# EAGLE design Wifi_micro (EAGLE 7.2.0)
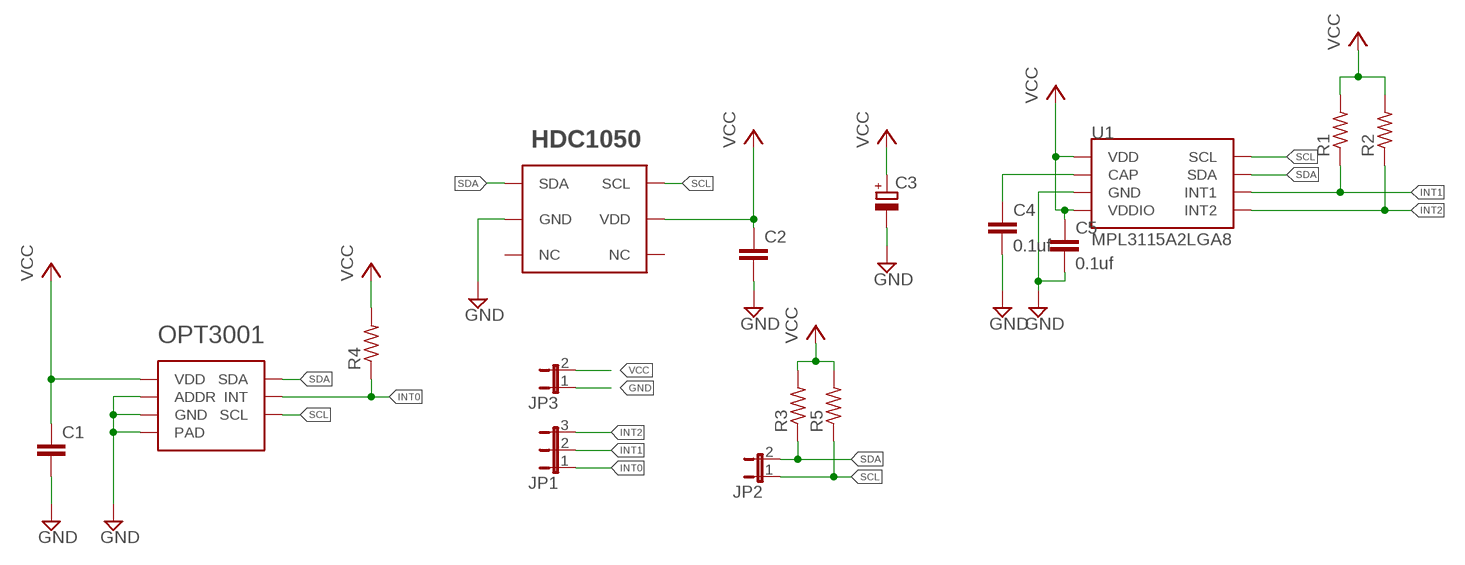
[diagram p0: schematic, sheet 1]

## Parts
C1  C-EUC1206  [C1206]
C2  C-EUC1206  [C1206]
C3  CPOL-EUE2.5-5  [E2,5-5]
C4  0.1uf  C-EUC1206  [C1206]
C5  0.1uf  C-EUC1206  [C1206]
HDC1050  HDC1050  [PWSON-6]
JP1  JP2E  [JP2]
JP2  JP1E  [JP1]
JP3  JP1E  [JP1]
OPT3001  OPT3001  [OPT3001]
R1  R-US_0204/5  [0204/5]
R2  R-US_0204/5  [0204/5]
R3  R-US_0204/5  [0204/5]
R4  R-US_0204/5  [0204/5]
R5  R-US_0204/5  [0204/5]
U1  MPL3115A2LGA8  [LGA8]

## Nets
GND: C1.2 C2.2 C3.- C4.2 C5.2 HDC1050.P$2(GND) JP3.1 OPT3001.P$2(ADDR) OPT3001.P$3(GND) OPT3001.P$7(PAD) U1.3(GND)
INT0: JP1.1 OPT3001.P$5(INT) R4.1
INT1: JP1.2 R1.1 U1.6(INT1)
INT2: JP1.3 R2.1 U1.5(INT2)
N$5: C4.1 U1.2(CAP)
SCL: HDC1050.P$6(SCL) JP2.1 OPT3001.P$4(SCL) R5.1 U1.8(SCL)
SDA: HDC1050.P$1(SDA) JP2.2 OPT3001.P$6(SDA) R3.1 U1.7(SDA)
VCC: C1.1 C2.1 C3.+ C5.1 HDC1050.P$5(VDD) JP3.2 OPT3001.P$1(VDD) R1.2 R2.2 R3.2 R4.2 R5.2 U1.1(VDD) U1.4(VDDIO)
Unconnected: HDC1050.P$3(NC) HDC1050.P$4(NC)

## Library data of the parts
C1 C2 C4 C5 = rcl:C-EU: CAPACITOR, European symbol
C3 = rcl:CPOL-EU: POLARIZED CAPACITOR, European symbol
HDC1050 = hdc1050:HDC1050: HDC1050 - Digital Humidity Sensor Technical Specifications: VCC: 2.7 - 5.5V Relative Humidity Accuracy ±3% Temperature Accuracy ±0.2°C Max Resolution: 14 bit Interface:I2C Operating Temperat ure: -40°C t o 125 °C Avg Current:710 nA @ 1sps, 11 bit RH Measurement 1.3 µA @ 1sps, 11 bit RH and Temperature 100 nA Sleep Mode Current
JP1 = jumper:JP2E: JUMPER
JP2 JP3 = jumper:JP1E: JUMPER
OPT3001 = my_own:OPT3001: OPT3001-Ambient Light Sensor Technical Specifications: VDD: 1.6 to 3.6V 5.5V tolerant I/O Operating Temp: -40 to 85C Package: USON-6
R1-R3 R5 = resistor:R-US_: RESISTOR, American symbol
R4 = rcl:R-US_: RESISTOR, American symbol
U1 = SparkFun-Sensors:MPL3115A2: Altimeter/Pressure Sensor, I2C, 1.95V-3.6V supply, 50 to 110kPa; PROD_ID: IC-10869

## Net classes
0 default: width 0.406 mm, drill 0.6 mm, clearance 0.305 mm

## Board
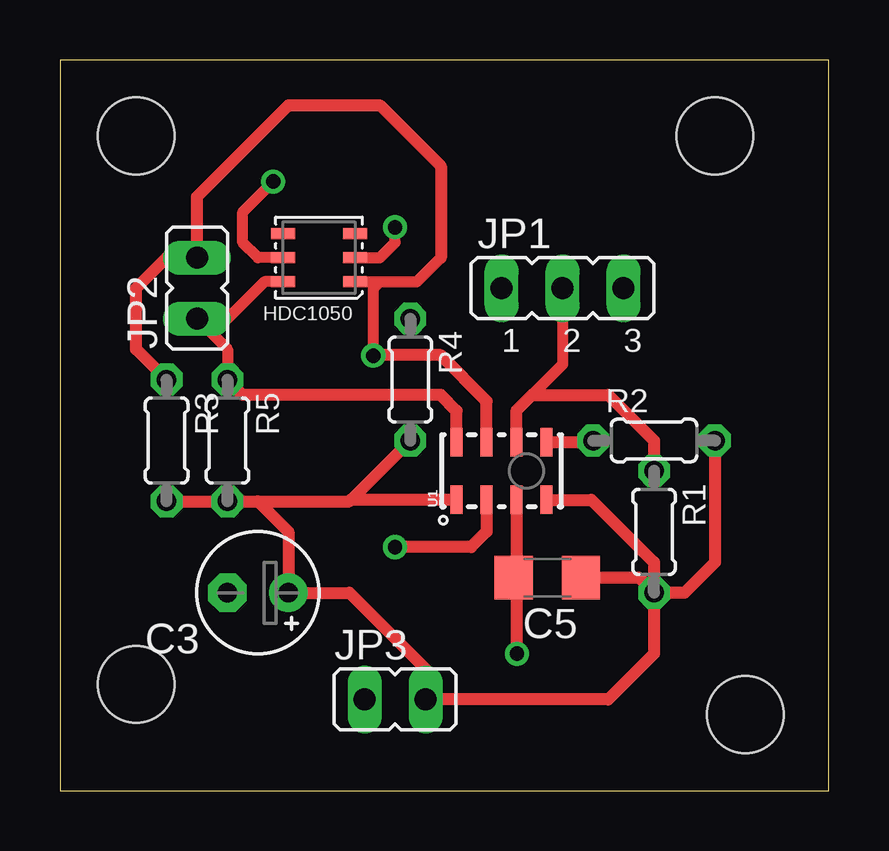
[diagram p1: board, top side]
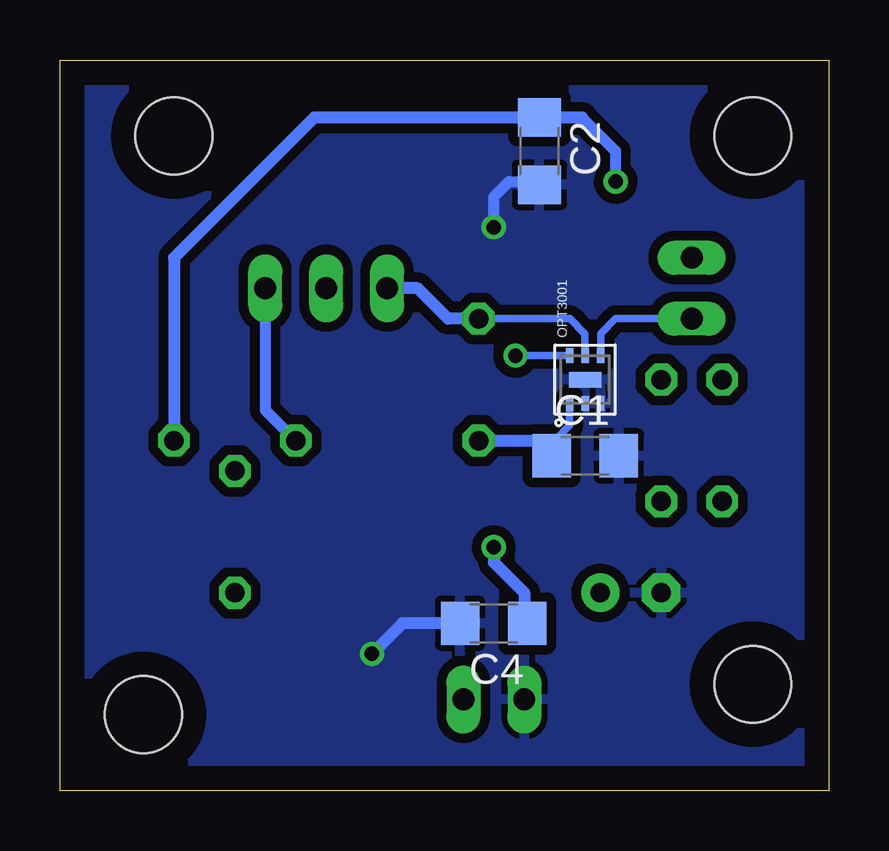
[diagram p2: board, bottom side, seen from below]

Size 32.06 x 30.47 mm. Coordinates in mm from the lower left corner, seen from the top.
Outline: 0,0 32.06,0 32.06,30.47 0,30.47 0,0
Copper layers (1*16): Top 0.035mm / dielectric 1.5mm / Bottom 0.035mm
Design rules "default": minimum track width 10mil, minimum drill 24mil, track to track 8mil, track to pad 8mil, pad to pad 8mil, via to via 8mil, smd to smd 8mil, copper to edge 40mil, drill to drill 8mil, minimum pad ring 10mil, minimum via ring 8mil, stop-mask expansion 4mil, vias tented up to drill 0mil, thermal gap 10mil
Holes 3.2 mm at 3.18,27.3 3.18,4.45 28.57,3.17 27.31,27.3

### Footprints (pad centres in the part's own frame; a part is rotated, then mirrored left to right if it is on the bottom)
C1206 = smd 1.6 x 1.8: 1 -1.4,0; 2 1.4,0
E2,5-5 = drill 0.813 pad 1.6: + -1.27,0 | drill 0.813 pad 1.6 octagon: - 1.27,0
PWSON-6 = smd 1 x 0.45: P$1 -1.5,1; P$2 -1.5,0; P$3 -1.5,-1; P$4 1.5,-1; P$5 1.5,0; P$6 1.5,1
JP2 = drill 0.914 long: 1 -2.54,0; 2 0,0; 3 2.54,0
JP1 = drill 0.914 long: 1 0,-1.27; 2 0,1.27
OPT3001 = smd 0.61 x 0.305: P$1 -1,0.65; P$2 -1,0; P$3 -1,-0.65; P$4 1,-0.65; P$5 1,0; P$6 1,0.65 | smd 0.65 x 1.35: P$7 0,0
0204/5 = drill 0.813 octagon: 1 -2.54,0; 2 2.54,0
LGA8 = smd 1.2 x 0.5: 1 -1.2,1.875; 2 -1.2,0.625; 3 -1.2,-0.625; 4 -1.2,-1.875; 5 1.2,-1.875; 6 1.2,-0.625; 7 1.2,0.625; 8 1.2,1.875

### Placement (x,y rotation side)
C1  10.16,13.97 0 bottom
C2  12.07,26.67 270 bottom
C3  8.26,8.26 180 top
C4  13.97,6.99 180 bottom
C5  20.32,8.89 180 top
HDC1050  10.8,22.22 180 top
JP1  20.96,20.95 0 top
JP2  5.71,20.95 0 top
JP3  13.97,3.81 270 top
OPT3001  10.16,17.14 90 bottom
R1  24.77,10.79 270 top
R2  24.77,14.61 0 top
R3  4.45,14.61 270 top
R4  14.61,17.14 270 top
R5  6.98,14.61 270 top
U1  18.41,13.34 90 top

### Tracks (layer width: path | path; a pad name or v marks a point on that pad's centre or on a via)
GND  (via drill 0.6)
  Top 0.457: HDC1050.P$2 13.34,22.22 13.97,22.86 v13.97,23.49
  Top 0.508: U1.3 19.04,9.01 C5.2 18.41,9.39 18.41,9.53 19.05,8.89 v19.05,5.71
  Bottom 0.457: v13.97,23.49 13.97,24.76 13.34,25.4 12.2,25.4 C2.2
  Bottom 0.508: C4.2 17.78,6.99 v19.05,5.71
  pour Bottom (isolate 0.406): 0.63,29.84 31.11,29.84 31.11,0.64 0.63,0.64
INT0
  Bottom 0.305: OPT3001.P$5 10.16,19.05 10.8,19.68 R4.1
  Bottom 0.508: R4.1 15.88,19.68 17.14,20.95 JP1.1
INT1
  Top 0.457: JP1.2 20.96,17.78 19.37,16.19
  Top 0.508: U1.6 19.04,15.87 19.37,16.19 19.68,16.51 22.86,16.51 24.77,14.61 R1.1
INT2
  Top 0.508: U1.5 22.16,14.54 R2.1
  Bottom 0.457: JP1.3 23.5,15.88 R2.1
N$5  (via drill 0.6)
  Top 0.508: U1.2 17.79,10.8 17.14,10.16 v13.97,10.16
  Bottom 0.508: v13.97,10.16 13.97,9.53 12.7,8.26 12.7,7.12 C4.1
SCL
  Top 0.457: R5.1 6.98,18.41 JP2.1 6.98,19.68 8.53,21.22 HDC1050.P$6
  Top 0.508: U1.8 16.54,15.85 15.88,16.51 7.62,16.51 R5.1
  Bottom 0.305: OPT3001.P$4 9.51,19.06 8.89,19.68 JP2.1
SDA  (via drill 0.6)
  Top 0.457: 15.88,22.22 14.88,21.22 13.34,21.22 | v13.07,18.14 13.07,20.95 13.34,21.22 | HDC1050.P$1 13.34,21.22
  Top 0.508: U1.7 17.79,16.25 15.88,18.16 13.08,18.16 v13.07,18.14 | R3.1 3.18,18.41 3.18,20.95 4.45,22.22 JP2.2 5.71,24.76 9.53,28.57 13.34,28.57 15.88,26.04 15.88,22.22
  Bottom 0.305: OPT3001.P$6 v13.07,18.14
VCC  (via drill 0.6)
  Top 0.457: HDC1050.P$5 8.26,22.22 7.62,22.86 7.62,24.13 v8.89,25.4
  Top 0.508: R2.2 27.31,9.53 26.04,8.26 R1.2 | R3.2 R5.2 | R5.2 12.07,12.06 12.14,12.13 | 12.14,12.13 R4.2 | U1.1 12.14,12.13 | R5.2 8.26,12.06 9.53,10.79 C3.+ 12.07,8.26 15.24,5.08 JP3.2 22.86,3.81 24.77,5.71 R1.2 | U1.4 22.16,12.13 24.77,9.53 R1.2 | C5.1 24.13,8.89 R1.2
  Bottom 0.305: OPT3001.P$1 10.81,15.22 11.43,14.61 11.43,14.1 C1.1
  Bottom 0.457: 10.29,28.07 8.89,26.67 v8.89,25.4
  Bottom 0.508: R4.2 11.43,14.61 | R2.2 27.31,22.22 21.46,28.07 C2.1 10.29,28.07